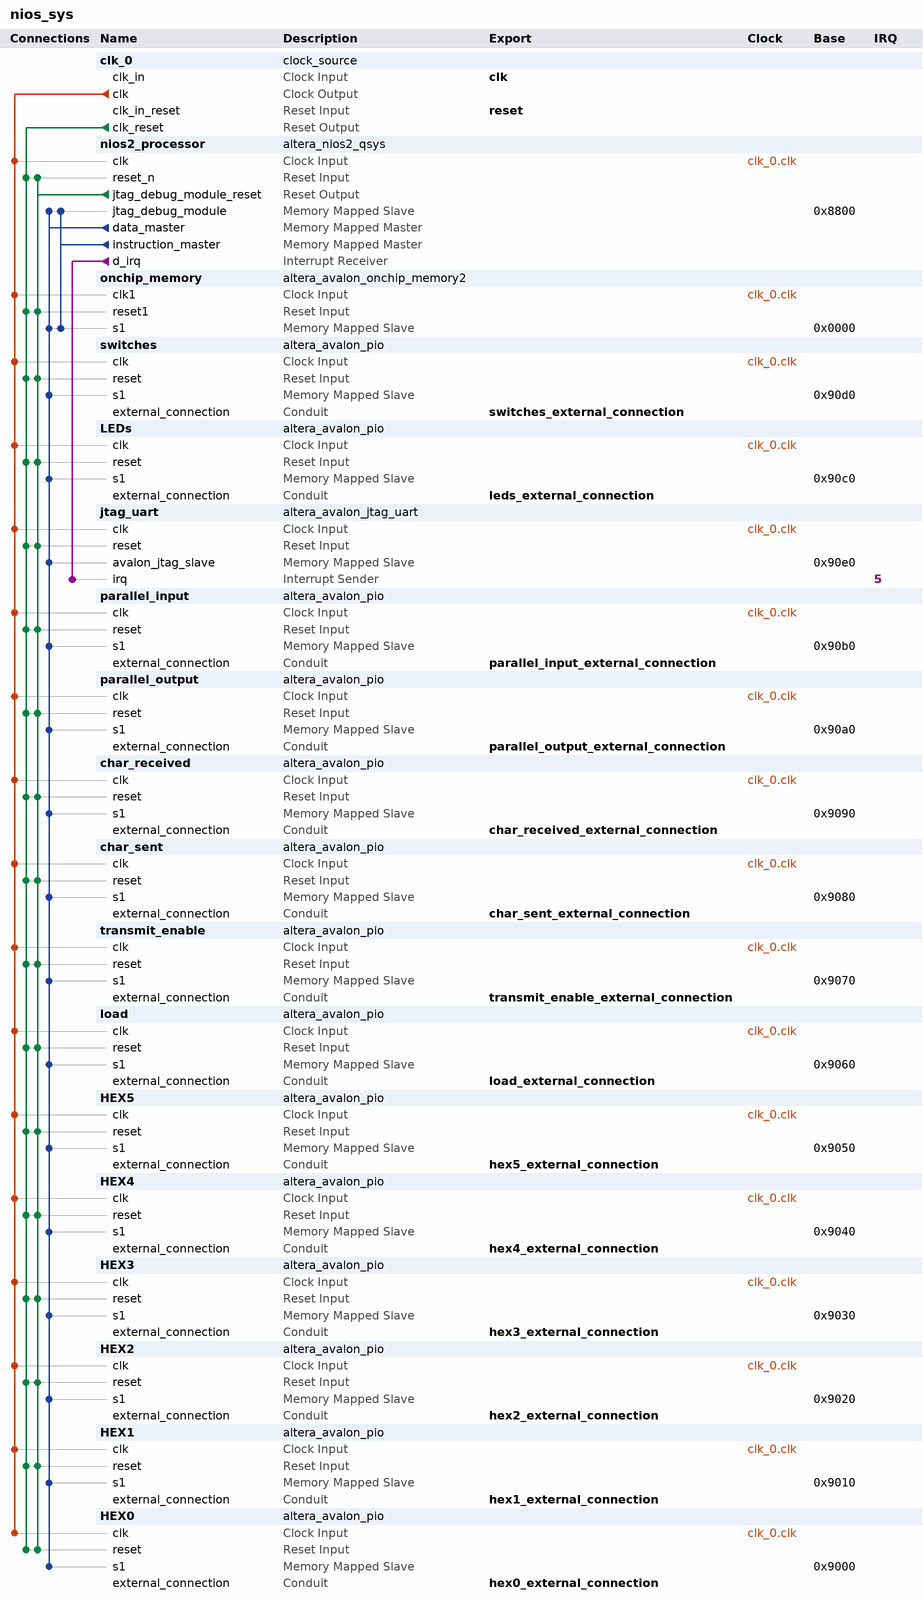
[diagram p0: system contents]
# Platform Designer (Qsys) system nios_sys, Cyclone V 5CSEMA5F31C6
# Parameters at their usual value, and those the tool derives, are not listed.
package require -exact qsys 16.0
create_system nios_sys
set_project_property DEVICE_FAMILY {Cyclone V}
set_project_property DEVICE 5CSEMA5F31C6

add_instance clk_0 clock_source 16.0
set_instance_parameter_value clk_0 clockFrequency 50000000

add_instance nios2_processor altera_nios2_qsys 16.0
set_instance_parameter_value nios2_processor breakSlave nios2_processor.jtag_debug_module
set_instance_parameter_value nios2_processor exceptionSlave onchip_memory.s1
set_instance_parameter_value nios2_processor icache_size 4096
set_instance_parameter_value nios2_processor impl Tiny
set_instance_parameter_value nios2_processor mmu_TLBMissExcSlave None
set_instance_parameter_value nios2_processor resetSlave onchip_memory.s1
set_instance_parameter_value nios2_processor resetrequest_enabled true

add_instance onchip_memory altera_avalon_onchip_memory2 16.0
set_instance_parameter_value onchip_memory dataWidth 32
set_instance_parameter_value onchip_memory dualPort false
set_instance_parameter_value onchip_memory initMemContent true
set_instance_parameter_value onchip_memory initializationFileName onchip_mem.hex
set_instance_parameter_value onchip_memory memorySize 32768

add_instance switches altera_avalon_pio 16.0
set_instance_parameter_value switches direction Input
set_instance_parameter_value switches width 8

add_instance LEDs altera_avalon_pio 16.0
set_instance_parameter_value LEDs direction Output
set_instance_parameter_value LEDs width 8

add_instance jtag_uart altera_avalon_jtag_uart 16.0
set_instance_parameter_value jtag_uart simInteractiveOptions NO_INTERACTIVE_WINDOWS

add_instance parallel_input altera_avalon_pio 16.0
set_instance_parameter_value parallel_input direction Output
set_instance_parameter_value parallel_input width 8

add_instance parallel_output altera_avalon_pio 16.0
set_instance_parameter_value parallel_output direction Input
set_instance_parameter_value parallel_output width 8

add_instance char_received altera_avalon_pio 16.0
set_instance_parameter_value char_received direction Input
set_instance_parameter_value char_received width 1

add_instance char_sent altera_avalon_pio 16.0
set_instance_parameter_value char_sent direction Input
set_instance_parameter_value char_sent width 1

add_instance transmit_enable altera_avalon_pio 16.0
set_instance_parameter_value transmit_enable direction Output
set_instance_parameter_value transmit_enable width 1

add_instance load altera_avalon_pio 16.0
set_instance_parameter_value load direction Output
set_instance_parameter_value load width 1

add_instance HEX5 altera_avalon_pio 16.0
set_instance_parameter_value HEX5 direction Output
set_instance_parameter_value HEX5 width 8

add_instance HEX4 altera_avalon_pio 16.0
set_instance_parameter_value HEX4 direction Output
set_instance_parameter_value HEX4 width 8

add_instance HEX3 altera_avalon_pio 16.0
set_instance_parameter_value HEX3 direction Output
set_instance_parameter_value HEX3 width 8

add_instance HEX2 altera_avalon_pio 16.0
set_instance_parameter_value HEX2 direction Output
set_instance_parameter_value HEX2 width 8

add_instance HEX1 altera_avalon_pio 16.0
set_instance_parameter_value HEX1 direction Output
set_instance_parameter_value HEX1 width 8

add_instance HEX0 altera_avalon_pio 16.0
set_instance_parameter_value HEX0 direction Output
set_instance_parameter_value HEX0 width 8

# connections
add_connection clk_0.clk char_received.clk clock
add_connection clk_0.clk char_sent.clk clock
add_connection clk_0.clk HEX0.clk clock
add_connection clk_0.clk HEX1.clk clock
add_connection clk_0.clk HEX2.clk clock
add_connection clk_0.clk HEX3.clk clock
add_connection clk_0.clk HEX4.clk clock
add_connection clk_0.clk HEX5.clk clock
add_connection clk_0.clk jtag_uart.clk clock
add_connection clk_0.clk LEDs.clk clock
add_connection clk_0.clk load.clk clock
add_connection clk_0.clk nios2_processor.clk clock
add_connection clk_0.clk onchip_memory.clk1 clock
add_connection clk_0.clk parallel_input.clk clock
add_connection clk_0.clk parallel_output.clk clock
add_connection clk_0.clk switches.clk clock
add_connection clk_0.clk transmit_enable.clk clock
add_connection clk_0.clk_reset char_received.reset reset
add_connection clk_0.clk_reset char_sent.reset reset
add_connection clk_0.clk_reset HEX0.reset reset
add_connection clk_0.clk_reset HEX1.reset reset
add_connection clk_0.clk_reset HEX2.reset reset
add_connection clk_0.clk_reset HEX3.reset reset
add_connection clk_0.clk_reset HEX4.reset reset
add_connection clk_0.clk_reset HEX5.reset reset
add_connection clk_0.clk_reset jtag_uart.reset reset
add_connection clk_0.clk_reset LEDs.reset reset
add_connection clk_0.clk_reset load.reset reset
add_connection clk_0.clk_reset nios2_processor.reset_n reset
add_connection clk_0.clk_reset onchip_memory.reset1 reset
add_connection clk_0.clk_reset parallel_input.reset reset
add_connection clk_0.clk_reset parallel_output.reset reset
add_connection clk_0.clk_reset switches.reset reset
add_connection clk_0.clk_reset transmit_enable.reset reset
add_connection nios2_processor.jtag_debug_module_reset char_received.reset reset
add_connection nios2_processor.jtag_debug_module_reset char_sent.reset reset
add_connection nios2_processor.jtag_debug_module_reset HEX0.reset reset
add_connection nios2_processor.jtag_debug_module_reset HEX1.reset reset
add_connection nios2_processor.jtag_debug_module_reset HEX2.reset reset
add_connection nios2_processor.jtag_debug_module_reset HEX3.reset reset
add_connection nios2_processor.jtag_debug_module_reset HEX4.reset reset
add_connection nios2_processor.jtag_debug_module_reset HEX5.reset reset
add_connection nios2_processor.jtag_debug_module_reset jtag_uart.reset reset
add_connection nios2_processor.jtag_debug_module_reset LEDs.reset reset
add_connection nios2_processor.jtag_debug_module_reset load.reset reset
add_connection nios2_processor.jtag_debug_module_reset nios2_processor.reset_n reset
add_connection nios2_processor.jtag_debug_module_reset onchip_memory.reset1 reset
add_connection nios2_processor.jtag_debug_module_reset parallel_input.reset reset
add_connection nios2_processor.jtag_debug_module_reset parallel_output.reset reset
add_connection nios2_processor.jtag_debug_module_reset switches.reset reset
add_connection nios2_processor.jtag_debug_module_reset transmit_enable.reset reset
add_connection nios2_processor.data_master char_received.s1 avalon
set_connection_parameter_value nios2_processor.data_master/char_received.s1 baseAddress 0x9090
add_connection nios2_processor.data_master char_sent.s1 avalon
set_connection_parameter_value nios2_processor.data_master/char_sent.s1 baseAddress 0x9080
add_connection nios2_processor.data_master HEX0.s1 avalon
set_connection_parameter_value nios2_processor.data_master/HEX0.s1 baseAddress 0x9000
add_connection nios2_processor.data_master HEX1.s1 avalon
set_connection_parameter_value nios2_processor.data_master/HEX1.s1 baseAddress 0x9010
add_connection nios2_processor.data_master HEX2.s1 avalon
set_connection_parameter_value nios2_processor.data_master/HEX2.s1 baseAddress 0x9020
add_connection nios2_processor.data_master HEX3.s1 avalon
set_connection_parameter_value nios2_processor.data_master/HEX3.s1 baseAddress 0x9030
add_connection nios2_processor.data_master HEX4.s1 avalon
set_connection_parameter_value nios2_processor.data_master/HEX4.s1 baseAddress 0x9040
add_connection nios2_processor.data_master HEX5.s1 avalon
set_connection_parameter_value nios2_processor.data_master/HEX5.s1 baseAddress 0x9050
add_connection nios2_processor.data_master jtag_uart.avalon_jtag_slave avalon
set_connection_parameter_value nios2_processor.data_master/jtag_uart.avalon_jtag_slave baseAddress 0x90e0
add_connection nios2_processor.data_master LEDs.s1 avalon
set_connection_parameter_value nios2_processor.data_master/LEDs.s1 baseAddress 0x90c0
add_connection nios2_processor.data_master load.s1 avalon
set_connection_parameter_value nios2_processor.data_master/load.s1 baseAddress 0x9060
add_connection nios2_processor.data_master nios2_processor.jtag_debug_module avalon
set_connection_parameter_value nios2_processor.data_master/nios2_processor.jtag_debug_module baseAddress 0x8800
add_connection nios2_processor.data_master onchip_memory.s1 avalon
set_connection_parameter_value nios2_processor.data_master/onchip_memory.s1 baseAddress 0x0000
add_connection nios2_processor.data_master parallel_input.s1 avalon
set_connection_parameter_value nios2_processor.data_master/parallel_input.s1 baseAddress 0x90b0
add_connection nios2_processor.data_master parallel_output.s1 avalon
set_connection_parameter_value nios2_processor.data_master/parallel_output.s1 baseAddress 0x90a0
add_connection nios2_processor.data_master switches.s1 avalon
set_connection_parameter_value nios2_processor.data_master/switches.s1 baseAddress 0x90d0
add_connection nios2_processor.data_master transmit_enable.s1 avalon
set_connection_parameter_value nios2_processor.data_master/transmit_enable.s1 baseAddress 0x9070
add_connection nios2_processor.instruction_master nios2_processor.jtag_debug_module avalon
set_connection_parameter_value nios2_processor.instruction_master/nios2_processor.jtag_debug_module baseAddress 0x8800
add_connection nios2_processor.instruction_master onchip_memory.s1 avalon
set_connection_parameter_value nios2_processor.instruction_master/onchip_memory.s1 baseAddress 0x0000
add_connection nios2_processor.d_irq jtag_uart.irq interrupt
set_connection_parameter_value nios2_processor.d_irq/jtag_uart.irq irqNumber 5

# exported interfaces
add_interface char_received_external_connection conduit end
set_interface_property char_received_external_connection EXPORT_OF char_received.external_connection
add_interface char_sent_external_connection conduit end
set_interface_property char_sent_external_connection EXPORT_OF char_sent.external_connection
add_interface clk clock sink
set_interface_property clk EXPORT_OF clk_0.clk_in
add_interface hex0_external_connection conduit end
set_interface_property hex0_external_connection EXPORT_OF HEX0.external_connection
add_interface hex1_external_connection conduit end
set_interface_property hex1_external_connection EXPORT_OF HEX1.external_connection
add_interface hex2_external_connection conduit end
set_interface_property hex2_external_connection EXPORT_OF HEX2.external_connection
add_interface hex3_external_connection conduit end
set_interface_property hex3_external_connection EXPORT_OF HEX3.external_connection
add_interface hex4_external_connection conduit end
set_interface_property hex4_external_connection EXPORT_OF HEX4.external_connection
add_interface hex5_external_connection conduit end
set_interface_property hex5_external_connection EXPORT_OF HEX5.external_connection
add_interface leds_external_connection conduit end
set_interface_property leds_external_connection EXPORT_OF LEDs.external_connection
add_interface load_external_connection conduit end
set_interface_property load_external_connection EXPORT_OF load.external_connection
add_interface parallel_input_external_connection conduit end
set_interface_property parallel_input_external_connection EXPORT_OF parallel_input.external_connection
add_interface parallel_output_external_connection conduit end
set_interface_property parallel_output_external_connection EXPORT_OF parallel_output.external_connection
add_interface reset reset sink
set_interface_property reset EXPORT_OF clk_0.clk_in_reset
add_interface switches_external_connection conduit end
set_interface_property switches_external_connection EXPORT_OF switches.external_connection
add_interface transmit_enable_external_connection conduit end
set_interface_property transmit_enable_external_connection EXPORT_OF transmit_enable.external_connection

set_interconnect_requirement {$system} qsys_mm.clockCrossingAdapter HANDSHAKE
set_interconnect_requirement {$system} qsys_mm.enableEccProtection FALSE
set_interconnect_requirement {$system} qsys_mm.insertDefaultSlave FALSE
set_interconnect_requirement {$system} qsys_mm.maxAdditionalLatency 1

save_system nios_sys.qsys
